# EAGLE design SDS011 (EAGLE 7.6.0)
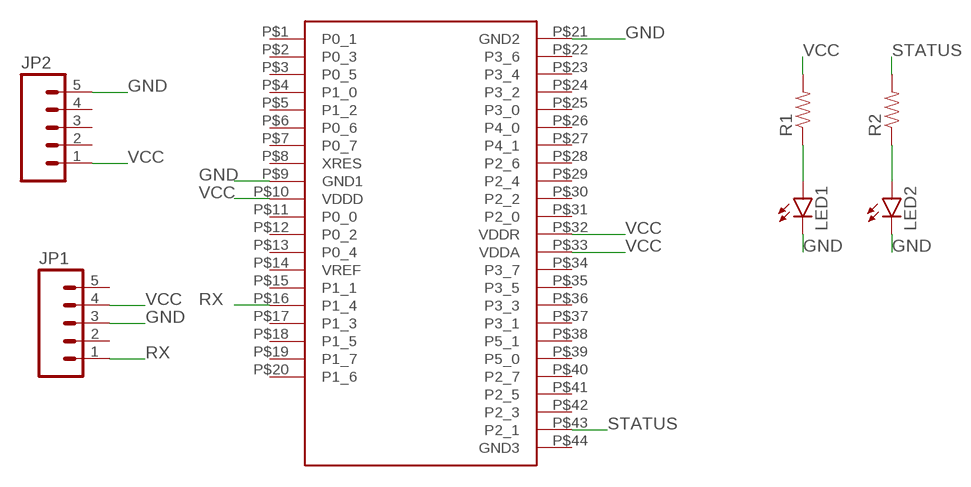
[diagram p0: schematic, sheet 1]

## Parts
JP1  M05PTH_LONGPADS  [1X05_LONGPADS]
JP2  M05PTH_LONGPADS  [1X05_LONGPADS]
LED1  LED3MM  [LED3MM]
LED2  LED3MM  [LED3MM]
R1  RESISTORPTH-1/4W  [AXIAL-0.4]
R2  RESISTORPTH-1/4W  [AXIAL-0.4]
U$1  CYBLE_MODULE  [CYBLE_MODULE]

## Nets
GND: JP1.3 JP2.5 LED1.K(C) LED2.K(C) U$1.P$9(GND1) U$1.P$21(GND2)
N$1: LED1.A R1.P$1
N$2: LED2.A R2.P$1
RX: JP1.1 U$1.P$16(P1_4)
STATUS: R2.P$2 U$1.P$43(P2_1)
VCC: JP1.4 JP2.1 R1.P$2 U$1.P$10(VDDD) U$1.P$32(VDDR) U$1.P$33(VDDA)
Unconnected: JP1.2 JP1.5 JP2.2 JP2.3 JP2.4 U$1.P$1(P0_1) U$1.P$2(P0_3) U$1.P$3(P0_5) U$1.P$4(P1_0) U$1.P$5(P1_2) U$1.P$6(P0_6) U$1.P$7(P0_7) U$1.P$8(XRES) U$1.P$11(P0_0) U$1.P$12(P0_2) U$1.P$13(P0_4) U$1.P$14(VREF) U$1.P$15(P1_1) U$1.P$17(P1_3) U$1.P$18(P1_5) U$1.P$19(P1_7) U$1.P$20(P1_6) U$1.P$22(P3_6) U$1.P$23(P3_4) U$1.P$24(P3_2) U$1.P$25(P3_0) U$1.P$26(P4_0) U$1.P$27(P4_1) U$1.P$28(P2_6) U$1.P$29(P2_4) U$1.P$30(P2_2) U$1.P$31(P2_0) U$1.P$34(P3_7) U$1.P$35(P3_5) U$1.P$36(P3_3) U$1.P$37(P3_1) U$1.P$38(P5_1) U$1.P$39(P5_0) U$1.P$40(P2_7) U$1.P$41(P2_5) U$1.P$42(P2_3) U$1.P$44(GND3)

## Library data of the parts
JP1 JP2 = SparkFun-Connectors:M05: Header 5 Standard 5-pin 0.1" header. Use with straight break away headers (SKU : PRT-00116), right angle break away headers (PRT-00553), swiss pins (PRT-00743), machine pins (PRT-00117), and female headers (PRT-00115). Molex polarized connector foot print use with SKU : PRT-08230 with associated crimp pins and housings.
LED1 LED2 = SparkFun-LED:LED: LEDs Standard schematic elements and footprints for 5mm, 3mm, 1206, and 0603 sized LEDs. 5mm - Spark Fun Electronics SKU : COM-00529 (and others)
R1 R2 = SparkFun-Resistors:RESISTOR: Resistor Basic schematic elements and footprints for 0603, 1206, and PTH resistors.
U$1 = CYBLE:CYBLE_MODULE

## Board
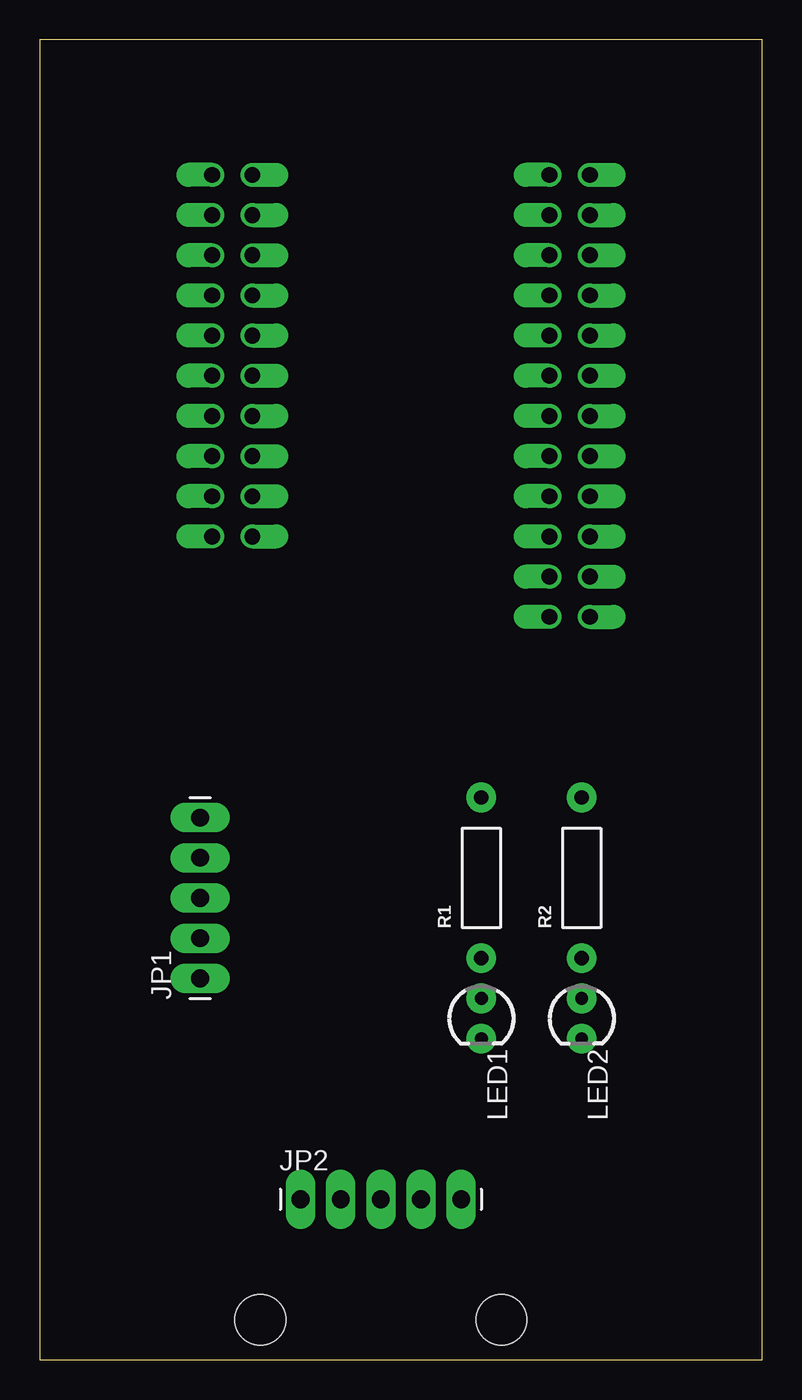
[diagram p1: board, top side]
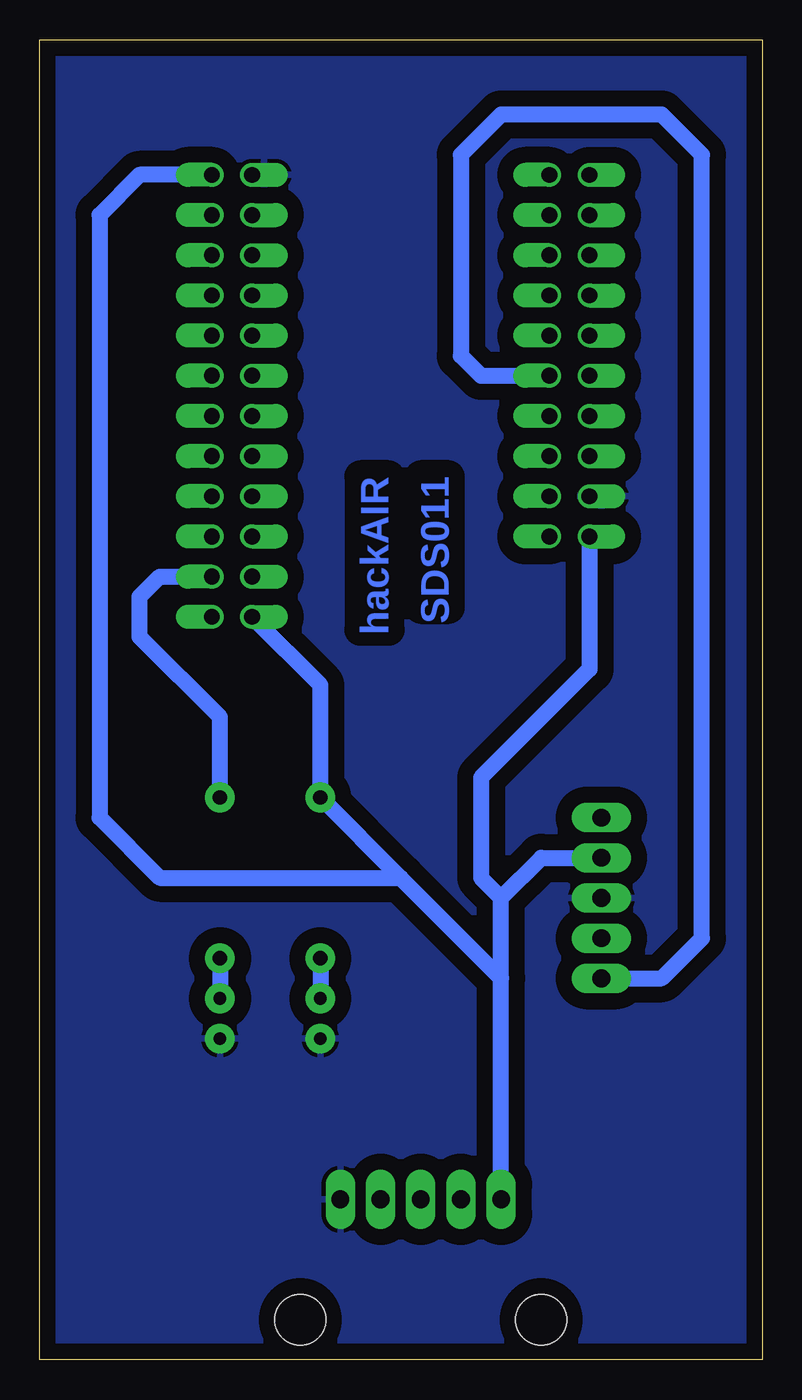
[diagram p2: board, bottom side, seen from below]

Size 45.7 x 83.49 mm. Coordinates in mm from the lower left corner, seen from the top.
Outline: 0,0 45.7,0 45.7,83.49 0,83.49 0,0
Copper layers (1*16): Top 0.035mm / dielectric 1.5mm / Bottom 0.035mm
Design rules "default": minimum track width 10mil, minimum drill 24mil, track to track 8mil, track to pad 8mil, pad to pad 8mil, via to via 8mil, smd to smd 8mil, copper to edge 40mil, drill to drill 8mil, minimum pad ring 10mil, minimum via ring 8mil, stop-mask expansion 4mil, vias tented up to drill 0mil, thermal gap 10mil
Holes 3.2 mm at 13.97,2.54 29.21,2.54

### Footprints (pad centres in the part's own frame; a part is rotated, then mirrored left to right if it is on the bottom)
1X05_LONGPADS = drill 1.118 pad 1.88 long: 1 0,0; 2 2.54,0; 3 5.08,0; 4 7.62,0; 5 10.16,0
LED3MM = drill 0.813 pad 1.88: A -1.27,0; K 1.27,0
AXIAL-0.4 = drill 0.9 pad 1.88: P$1 -5.08,0; P$2 5.08,0
CYBLE_MODULE = drill 1 offset: P$1 -11.938,15.24; P$2 -11.938,12.7; P$3 -11.938,10.16; P$4 -11.938,7.62; P$5 -11.938,5.08; P$6 -11.938,2.54; P$7 -11.938,0; P$8 -11.938,-2.54; P$9 -11.938,-5.08; P$10 -11.938,-7.62; P$11 -9.398,15.24; P$12 -9.398,12.7; P$13 -9.398,10.16; P$14 -9.398,7.62; P$15 -9.398,5.08; P$16 -9.398,2.54; P$17 -9.398,0; P$18 -9.398,-2.54; P$19 -9.398,-5.08; P$20 -9.398,-7.62; P$21 9.398,15.24; P$22 9.398,12.7; P$23 9.398,10.16; P$24 9.398,7.62; P$25 9.398,5.08; P$26 9.398,2.54; P$27 9.398,0; P$28 9.398,-2.54; P$29 9.398,-5.08; P$30 9.398,-7.62; P$31 9.398,-10.16; P$32 9.398,-12.7; P$33 11.938,15.24; P$34 11.938,12.7; P$35 11.938,10.16; P$36 11.938,7.62; P$37 11.938,5.08; P$38 11.938,2.54; P$39 11.938,0; P$40 11.938,-2.54; P$41 11.938,-5.08; P$42 11.938,-7.62; P$43 11.938,-10.16; P$44 11.938,-12.7

### Placement (x,y rotation side)
JP1  10.16,24.13 90 top
JP2  16.51,10.16 0 top
LED1  27.94,21.59 270 top
LED2  34.29,21.59 270 top
R1  27.94,30.48 90 top
R2  34.29,30.48 90 top
U$1  22.86,59.69 0 top

### Tracks (layer width: path | path; a pad name or v marks a point on that pad's centre or on a via)
GND
  pour Bottom (isolate 1.016): 0,83.82 45.72,83.82 45.72,0 0,0
N$1
  Bottom 1.016: R1.P$1 LED1.A
N$2
  Bottom 1.016: R2.P$1 LED2.A
RX
  Bottom 1.016: JP1.1 6.35,24.13 3.81,26.67 3.81,76.2 6.35,78.74 16.51,78.74 19.05,76.2 19.05,63.5 17.78,62.23 U$1.P$16
STATUS
  Bottom 1.016: R2.P$2 34.29,40.64 39.37,45.72 39.37,48.26 38.1,49.53 U$1.P$43
VCC
  Bottom 1.016: JP2.1 16.51,24.13 | 22.86,30.48 R1.P$2 27.94,42.67 U$1.P$32 | U$1.P$33 39.37,74.93 41.91,72.39 41.91,34.29 38.1,30.48 22.86,30.48 | 16.51,24.13 22.86,30.48 | 16.51,24.13 16.51,29.21 | 16.51,29.21 13.97,31.75 JP1.4 | U$1.P$10 10.92,43.69 17.78,36.83 17.78,30.48 16.51,29.21

### Text on the board
Bottom: SDS011 | hackAIR